# Altium schematic sheet LoRa.SchDoc
size A
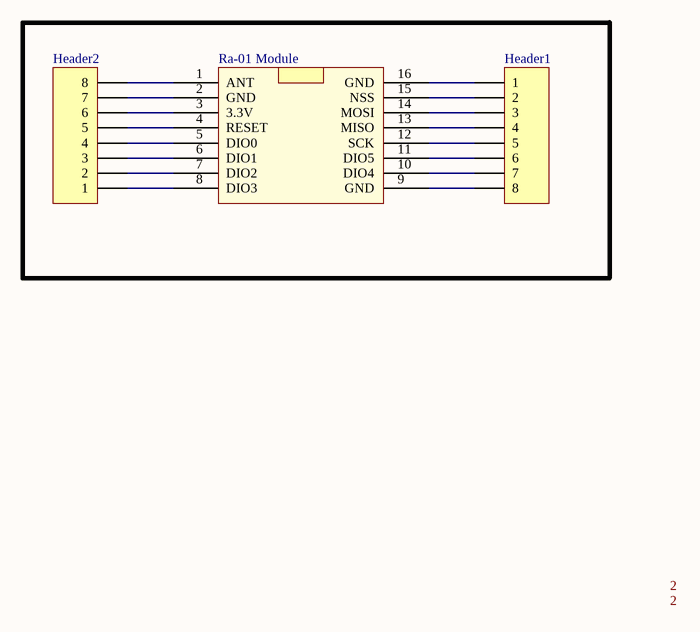
[diagram p0: LoRa.SchDoc]

## Parts
Header1  (no value)  [HDR1X8]
Header2  (no value)  [HDR1X8]
Ra-01_Module  Ra-01 Module  [Ra-01]  (value not drawn)

## Nets
NetHeader1_1: Header1.1 Ra-01_Module.16(GND)
NetHeader1_2: Header1.2 Ra-01_Module.15(NSS)
NetHeader1_3: Header1.3 Ra-01_Module.14(MOSI)
NetHeader1_4: Header1.4 Ra-01_Module.13(MISO)
NetHeader1_5: Header1.5 Ra-01_Module.12(SCK)
NetHeader1_6: Header1.6 Ra-01_Module.11(DIO5)
NetHeader1_7: Header1.7 Ra-01_Module.10(DIO4)
NetHeader1_8: Header1.8 Ra-01_Module.9(GND)
NetHeader2_1: Header2.1 Ra-01_Module.8(DIO3)
NetHeader2_2: Header2.2 Ra-01_Module.7(DIO2)
NetHeader2_3: Header2.3 Ra-01_Module.6(DIO1)
NetHeader2_4: Header2.4 Ra-01_Module.5(DIO0)
NetHeader2_5: Header2.5 Ra-01_Module.4(RESET)
NetHeader2_6: Header2.6 Ra-01_Module.3(3.3V)
NetHeader2_7: Header2.7 Ra-01_Module.2(GND)
NetHeader2_8: Header2.8 Ra-01_Module.1(ANT)

## Notes on the sheet
- Labels drawn without touching a wire or pin: 2

## Library data of the parts
Header1 Header2 = Header 8: Header, 8-Pin; LatestRevisionDate: 17-Jul-2002; LatestRevisionNote: Re-released for DXP Platform.; Publisher: Altium Limited